# Altium project RHC12.PrjPcb
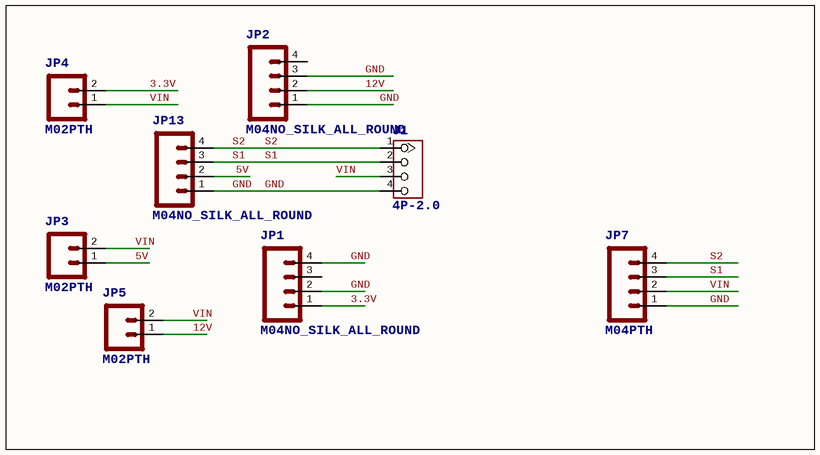
[diagram p0: RHC12.SchDoc]
1 sheet, 8 parts. Net scope: global (net labels, ports and power ports of the same name join across sheets).
Board file: RHC12.PcbDoc

## Sheet RHC12.SchDoc
size 143 x 78 mm

### Parts
J1  4P-2.0  [HW4-2.0]
JP1  M04NO_SILK_ALL_ROUND  [1X04_NO_SILK_ALL_ROUND]
JP2  M04NO_SILK_ALL_ROUND  [1X04_NO_SILK_ALL_ROUND]
JP3  M02PTH  [1X02]
JP4  M02PTH  [1X02]
JP5  M02PTH  [1X02]
JP7  M04PTH  [1X04]
JP13  M04NO_SILK_ALL_ROUND  [1X04_NO_SILK_ALL_ROUND]

### Nets
3.3V: JP1.1 JP4.2
5V: JP3.1 JP13.2
12V: JP2.2 JP5.1
GND: J1.4 JP1.2 JP1.4 JP2.1 JP2.3 JP7.1 JP13.1
S1: J1.2 JP7.3 JP13.3
S2: J1.1 JP7.4 JP13.4
VIN: J1.3 JP3.2 JP4.1 JP5.2 JP7.2

Not connected (* = marked no-connect by the designer): JP1 3; JP2 4

### Library data of the parts
J1 = GROVE-CONNECTOR-DIP(4P-2.0): 320110033; VALUE: 4P-2.0
JP1 JP2 JP13 = M04NO_SILK_ALL_ROUND: Header 4Standard 4-pin 0.1" header. Use with straight break away headers (SKU : PRT-00116), right angle break away headers (PRT-00553), swiss pins (PRT-00743), machine pins (PRT-00117), and female headers (PRT-00115). Molex polarized connector foot print use with SKU : PRT-08231 with associated crimp pins and housings. 1MM SMD Version SKU: PRT-10208
JP3-JP5 = M02PTH: Standard 2-pin 0.1" header. Use with  - straight break away headers ( PRT-00116) - right angle break away headers (PRT-00553) - swiss pins (PRT-00743) - machine pins (PRT-00117) - female headers (PRT-00115)   Molex polarized connector foot print use with: PRT-08233 with associated crimp pins and housings.  2.54_SCREWTERM for use with  PRT-10571.  3.5mm Screw Terminal footprints for  PRT-08084  5mm Screw Terminal footprints for use with PRT-08432
JP7 = M04PTH: Header 4Standard 4-pin 0.1" header. Use with straight break away headers (SKU : PRT-00116), right angle break away headers (PRT-00553), swiss pins (PRT-00743), machine pins (PRT-00117), and female headers (PRT-00115). Molex polarized connector foot print use with SKU : PRT-08231 with associated crimp pins and housings. 1MM SMD Version SKU: PRT-10208